# Altium schematic sheet 5v_Reg_biggr.SchDoc: 5V Digital regulator
size A4; Organization: Altium Limited; Address1: L3, 12a Rodborough Rd; Address2: Frenchs Forest; Address3: NSW; Address4: Australia 2086
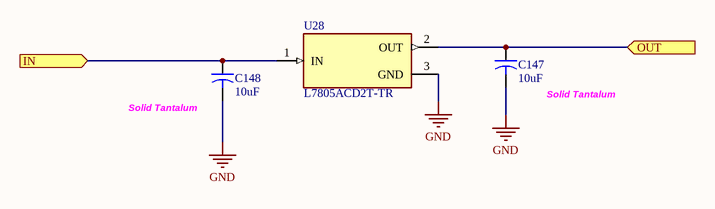
[diagram p0: 5v_Reg_biggr.SchDoc]

## Parts
C147  10uF  [Tantalum_2917]
C148  10uF  [Tantalum_2917]
U28  L7805ACD2T-TR  [TO254P1515X470-3N]

## Ports
IN (in), OUT (in)

## Nets
GND: C147.2 C148.2 U28.3(GND)
IN: C148.1 U28.1(IN) ; port IN
OUT: C147.1 U28.2(OUT) ; port OUT

## Notes on the sheet
- (near C148) Solid Tantalum
- (near C147) Solid Tantalum
- Title
- Date:
- RE:
- Arturo di Girolamo
- Size:
- A3
- A

## Library data of the parts
C147 C148 = UVR1V102MHD1TO: Capacitor, 100uF NICHICON; ASYPN: T495D106K035ATE260; MFGPN: UVR1V102MHD1TO
U28 = L7805ACD2T-TR: Linear Voltage Regulator IC 1 Output 1.5A D2PAK; MF: STMicroelectronics; Price: None; MP: L7805ACD2T-TR; Purchase-URL: https://pricing.snapeda.com/search/part/L7805ACD2T-TR/?ref=eda; Package: D2PAK STMicroelectronics; Check_prices: https://www.snapeda.com/parts/L7805ACD2T-TR/STMicroelectronics/view-part/104395/?ref=eda; SnapEDA_Link: https://www.snapeda.com/parts/L7805ACD2T-TR/STMicroelectronics/view-part/104395/?ref=snap; Value: *; Availability: Good; ASYPN: L7805ACD2T-TR